# Altium schematic sheet Poactuator_KillSwitch.SchDoc: Sample Sheet Title
size B; Date: MM/DD/YYYY; Author: Sample Author; Organization: ORGANIZATION; Address1: ADDRESS 1; Address2: ADDRESS 2; Address3: ADDRESS 3; Address4: ADDRESS 4; Revision: -; SheetNumber: 4; SheetTotal: 6; ENG_APP_DATE: --/--/--; DSN_APP_DATE: --/--/--; CHK_APP_DATE: --/--/--
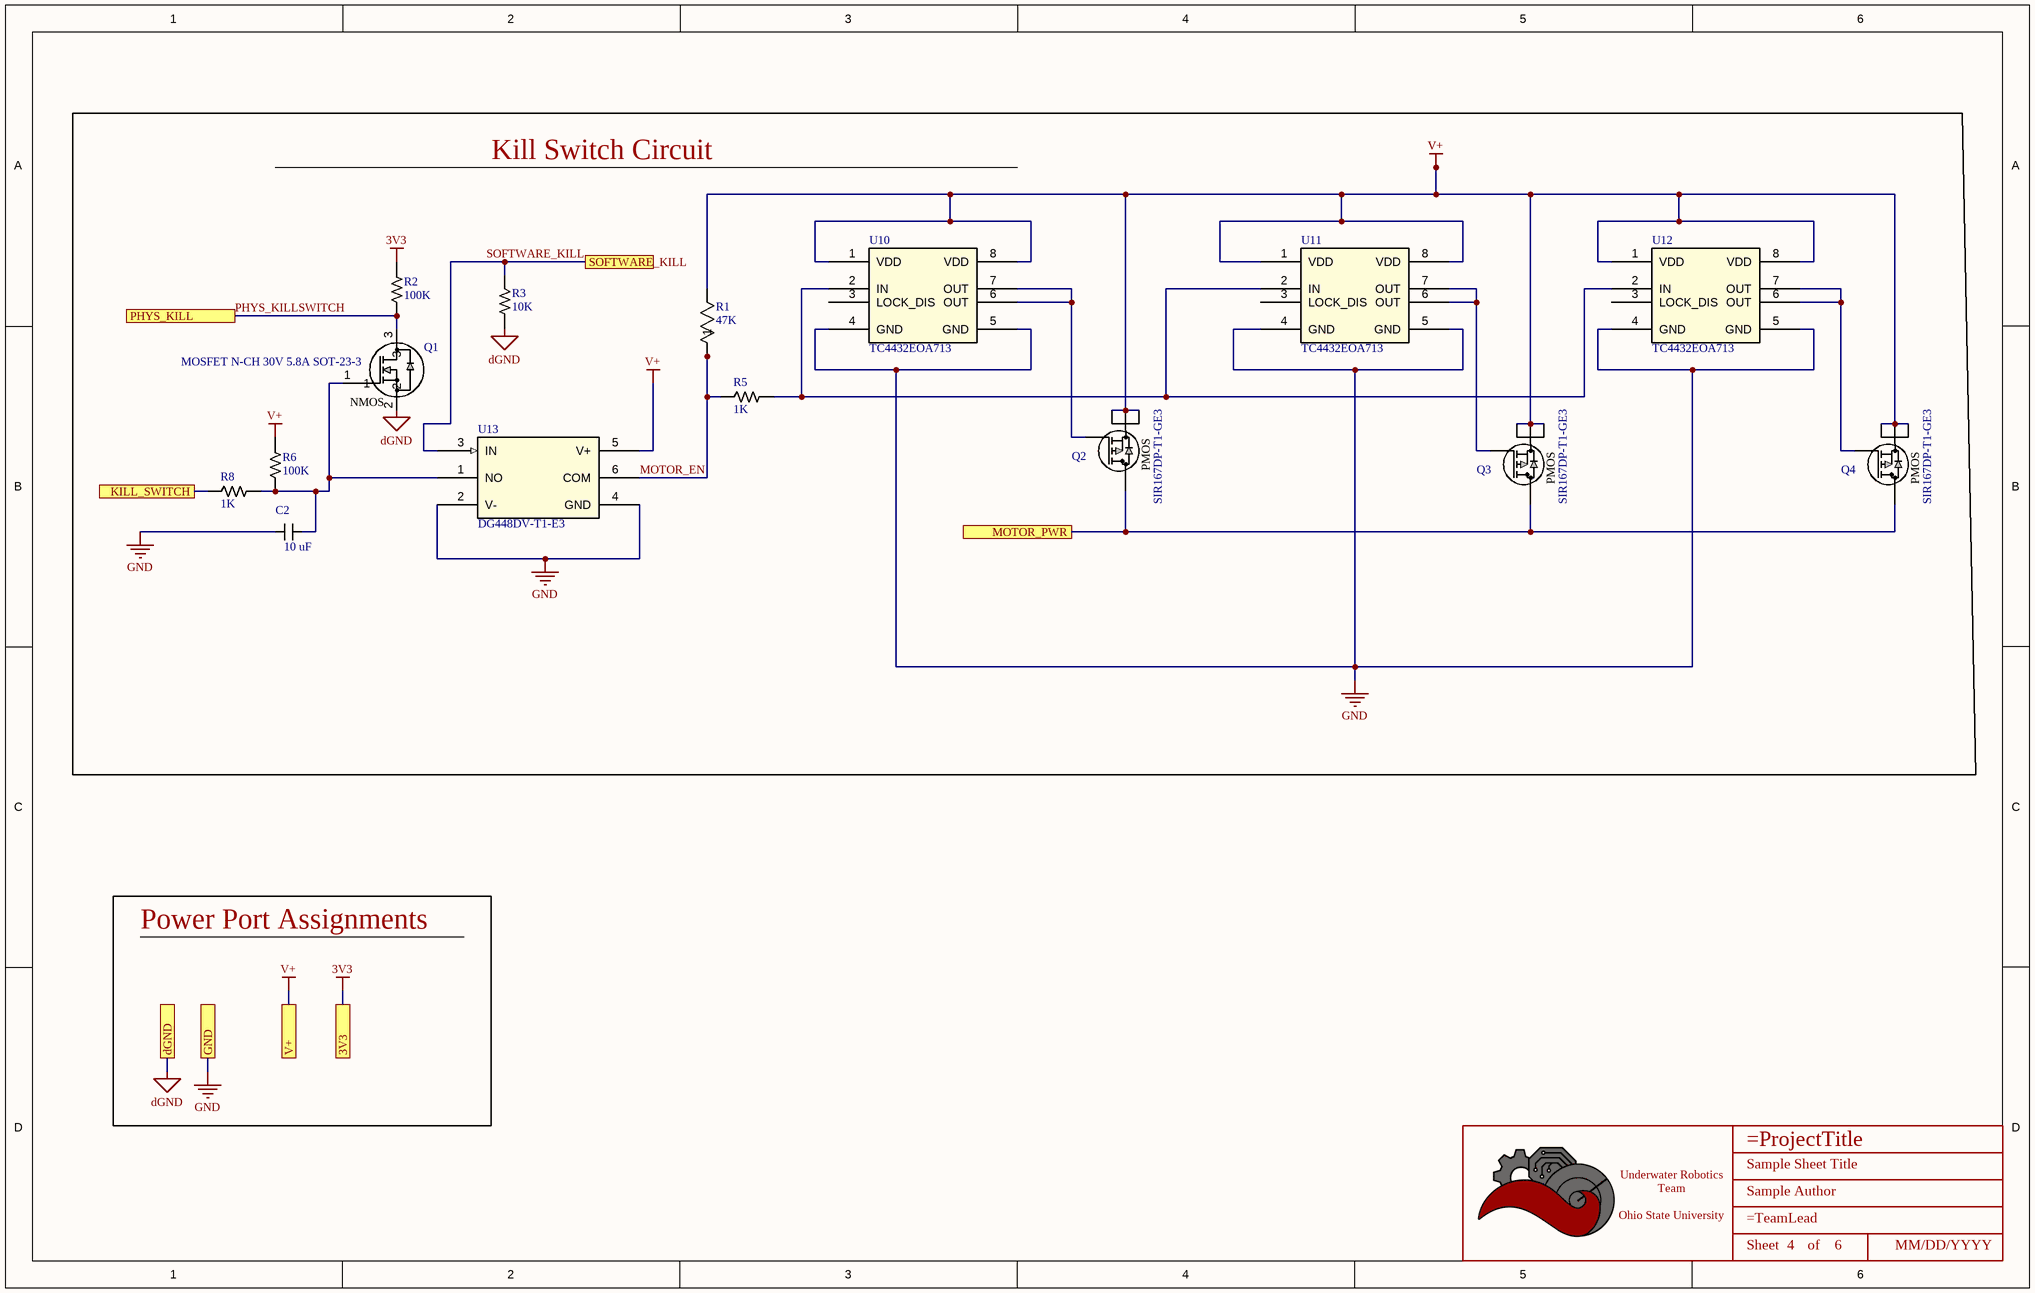
[diagram p0: Poactuator_KillSwitch.SchDoc]

## Parts
*  Title_Block  [LOGO]  (value not drawn)  (graphical)
C2  Value (uF): 10 uF  [CAPACITOR_1206]  (hidden comment: 10uF Ceramic 25V)
Q1  MOSFET N-CH 30V 5.8A SOT-23-3  [SOT-23-3]
Q2  SIR167DP-T1-GE3  [MOSFET_7DP-T1-GE3_VIS]
Q3  SIR167DP-T1-GE3  [MOSFET_7DP-T1-GE3_VIS]
Q4  SIR167DP-T1-GE3  [MOSFET_7DP-T1-GE3_VIS]
R1  47K  [RES_RC0603_YAG]
R2  Value  (Ohms): 100K  [RESISTOR_0603]  (hidden comment: 100k Ohm 0.5% 1/10W)
R3  Value  (Ohms): 10K  [RESISTOR_0603]  (hidden comment: 10k Ohm 5% 1/10W)
R5  Value  (Ohms): 1K  [RESISTOR_0402]  (hidden comment: 1k Ohm 1% 1/16W)
R6  Value  (Ohms): 100K  [RESISTOR_0603]  (hidden comment: 100k Ohm 0.5% 1/10W)
R8  Value  (Ohms): 1K  [RESISTOR_0603]  (hidden comment: 1k Ohm 5% 1/8W)
U10  TC4432EOA713  [SOIC8-N_MC_MCH]
U11  TC4432EOA713  [SOIC8-N_MC_MCH]
U12  TC4432EOA713  [SOIC8-N_MC_MCH]
U13  DG448DV-T1-E3  [TSOP6_DG_VIS-M]

## Blocks framed on the sheet
Kill Switch Circuit: C2 Q1-Q4 R1-R3 R5 R6 R8 U10-U13

## Ports
3V3, dGND, GND, KILL_SWITCH, MOTOR_PWR, PHYS_KILL, SOFTWARE_KILL, V+

## Nets
3V3: R2.1 ; port 3V3
dGND: Q1.2 R3.1 ; port dGND
GND: C2.2 U10.4(GND) U10.5(GND) U11.4(GND) U11.5(GND) U12.4(GND) U12.5(GND) U13.2(V-) U13.4(GND) ; port GND
V+: Q2.1(S) Q2.2(S) Q2.3(S) Q3.1(S) Q3.2(S) Q3.3(S) Q4.1(S) Q4.2(S) Q4.3(S) R1.2 R6.1 U10.1(VDD) U10.8(VDD) U11.1(VDD) U11.8(VDD) U12.1(VDD) U12.8(VDD) U13.5(V+) ; port V+
KILL_SWITCH: R8.2 ; port KILL_SWITCH
MOTOR_EN: R1.1 R5.2 U13.6(COM)
MOTOR_PWR: Q2.D Q3.D Q4.D ; port MOTOR_PWR
PHYS_KILLSWITCH: Q1.3 R2.2 ; port PHYS_KILL
SOFTWARE_KILL: R3.2 U13.3(IN) ; port SOFTWARE_KILL
NetC2_1: C2.1 Q1.1 R6.2 R8.1 U13.1(NO)
NetQ2_4: Q2.4(G) U10.6(OUT) U10.7(OUT)
NetQ3_4: Q3.4(G) U11.6(OUT) U11.7(OUT)
NetQ4_4: Q4.4(G) U12.6(OUT) U12.7(OUT)
NetR5_1: R5.1 U10.2(IN) U11.2(IN) U12.2(IN)

Not connected (* = marked no-connect by the designer): U10 3(LOCK_DIS); U11 3(LOCK_DIS); U12 3(LOCK_DIS)

## Notes on the sheet
- Power Port Assignments
- DWG. NO.
- REV.
- SHT.
- THIS DOCUMENT AND THE DATA DISCLOSED HEREIN OR HEREWITH IS THE PROPERTY OF ALTIUM LIMITED AND MAY BE FREELY DISTRIBUTED IN WHOLE. NO RIGHTS ARE RESERVED OR EXPRESS OR IMPLIED WARANTEE GIVEN.
- REVISION
- DESCRIPTION
- DATE
- APPROVED
- ENG:
- APPROVALS
- PROJECT
- DSN:
- CHK:
- REFERENCE DOCUMENTS
- PROJECT REVISION:
- TITLE
- DOCUMENT REVISION:
- DESIGN ITEM:
- BOM:
- FAB DWG:
- PCB DWG:
- ASSY DWG:
- SCALE:
- SIZE
- B
- CAGE CODE
- FILE NAME
- DWG NO.
- SHEET
- OF
- REV
- (in symbol AO3404A) NMOS
- (in symbol SIR167DP-T1-GE3) PMOS
- (in symbol Title_Block) Underwater Robotics Team / Ohio State University; Sheet; of

## Library data of the parts
* = Title_Block: UWRT Schematic Title Block Template / Created June 2021, Dylan Trainor
C2 = CAPACITOR_10uF_1206: Cap 10uF 25V +/-10% / Ceramic 1206; Made By: Robert Pafford; Tolerance: +/- 10%; Voltage: 25V; Supplier 1: Digi-Key; Supplier Part Number 1: 1276-1804-6-ND
Q1 = AO3404A: N-Channel 30 V 5.8A (Ta) 1.4W (Ta) Surface Mount SOT-23-3; Vendor: Alpha & Omega Semiconductor Inc.; SourceLibrary: ON_Semiconductor_2020-01-13; Vgs (Max): 3V @ 5.8A, 10V; Vgs (th): 3V @ 250µA; Rds (on): 28mOhm @ 5.8A, 10V; Amp Rating: 5.8 A; FET Type: N-Channel; Package: SOT23-3L; Manufacturer _Part_Number: AO3404A; Vdss: 30V; Power Dissipation: 1.4W (Ta); Supplier 1: Digi-Key; Supplier Part Number 1: 785-1004-1-ND; Created By: Dylan T
Q2-Q4 = SIR167DP-T1-GE3: P-Channel 30 V 60A (Tc) 65.8W (Tc) Surface Mount PowerPAK® SO-8; Mfr_Name: Vishay; Type: DEV; Copyright: Copyright (C) 2022 Ultra Librarian. All rights reserved.; Manufacturer_Part_Number: SIR167DP-T1-GE3; RefDes: RefDes; Supplier 1: Mouser; Supplier Part Number 1: 78-SIR167DP-T1-GE3
R1 = RC0603JR-1347KL: 47kohm 0603 1/10w; Mfr_Name: Yageo; Copyright: Copyright (C) 2024 Ultra Librarian. All rights reserved.; Manufacturer_Part_Number: RC0603JR-1347KL; RefDes: RefDes; Type: DEV; Supplier 1: Mouser; Supplier Part Number 1: 667-ERJ-3GEYJ473V
R2 R6 = RESISTOR_100K_0.5%_0603: RES 100k OHM 0.5% 1/10W 0603; Tolerance: +/- 0.5%; Made By: John Ulm; ComponentLink1Description: Datasheet; ComponentLink1URL: https://www.bourns.com/docs/product-datasheets/CRxxxxx.pdf; Wattage: 1/10W; Supplier: Digikey; Digikey Part Numer: CR0603-JW-104ELFTR-ND; Supplier 1: Digi-Key; Supplier Part Number 1: 311-2395-1-ND
R3 = RESISTOR_10K_0603: RES 10k OHM 5% 1/10W 0603; Tolerance: +/- 5%; Wattage: 1/8W; Made By: Robert Pafford; ComponentLink1Description: Datasheet; ComponentLink1URL: https://www.bourns.com/docs/product-datasheets/CRxxxxx.pdf; Supplier: Digikey; Digikey Part Numer: CR0603-JW-104ELFTR-ND; Supplier 1: Digi-Key; Supplier Part Number 1: 2019-RK73B1JTTD103JCT-ND
R5 = RESISTOR_1K_0402: RES 1k OHM 1% 1/16W 0402; Tolerance: +/- 1%; Made By: Robert Pafford; Wattage: 1/16W; Supplier: Digikey; Digikey Part Numer: CR0603-JW-104ELFTR-ND; Supplier 1: Digi-Key; Supplier Part Number 1: 13-AC0402FR-131KLCT-ND
R8 = RESISTOR_1K_0603: RES 1k OHM 5% 1/8W 0603; Tolerance: +/- 5%; Made By: Robert Pafford; ComponentLink1Description: Datasheet; ComponentLink1URL: https://www.bourns.com/docs/product-datasheets/CRxxxxx.pdf; Wattage: 1/8W; Supplier: Digikey; Digikey Part Numer: CR0603-JW-104ELFTR-ND; Supplier 1: Digi-Key; Supplier Part Number 1: 2019-RK73B1JTTD102JCT-ND
U10-U12 = TC4432EOA713: High-Side or Low-Side Gate Driver IC Non-Inverting 8-SOIC; Mfr_Name: Microchip; Copyright: Copyright (C) 2024 Ultra Librarian. All rights reserved.; Manufacturer_Part_Number: TC4432EOA713; RefDes: RefDes; Type: DEV; Supplier 1: Digikey; Supplier Part Number 1: TC4432EOA713CT-ND
U13 = DG448DV-T1-E3: IC SWITCH SPST-NOX1 25OHM 6TSOP; Mfr_Name: Vishay; Copyright: Copyright (C) 2024 Ultra Librarian. All rights reserved.; Manufacturer_Part_Number: DG448DV-T1-E3; RefDes: RefDes; Type: DEV; Supplier 1: Mouser; Supplier Part Number 1: 781-DG448DV-E3